# EAGLE design ev_ver_3 (EAGLE 9.6.2)
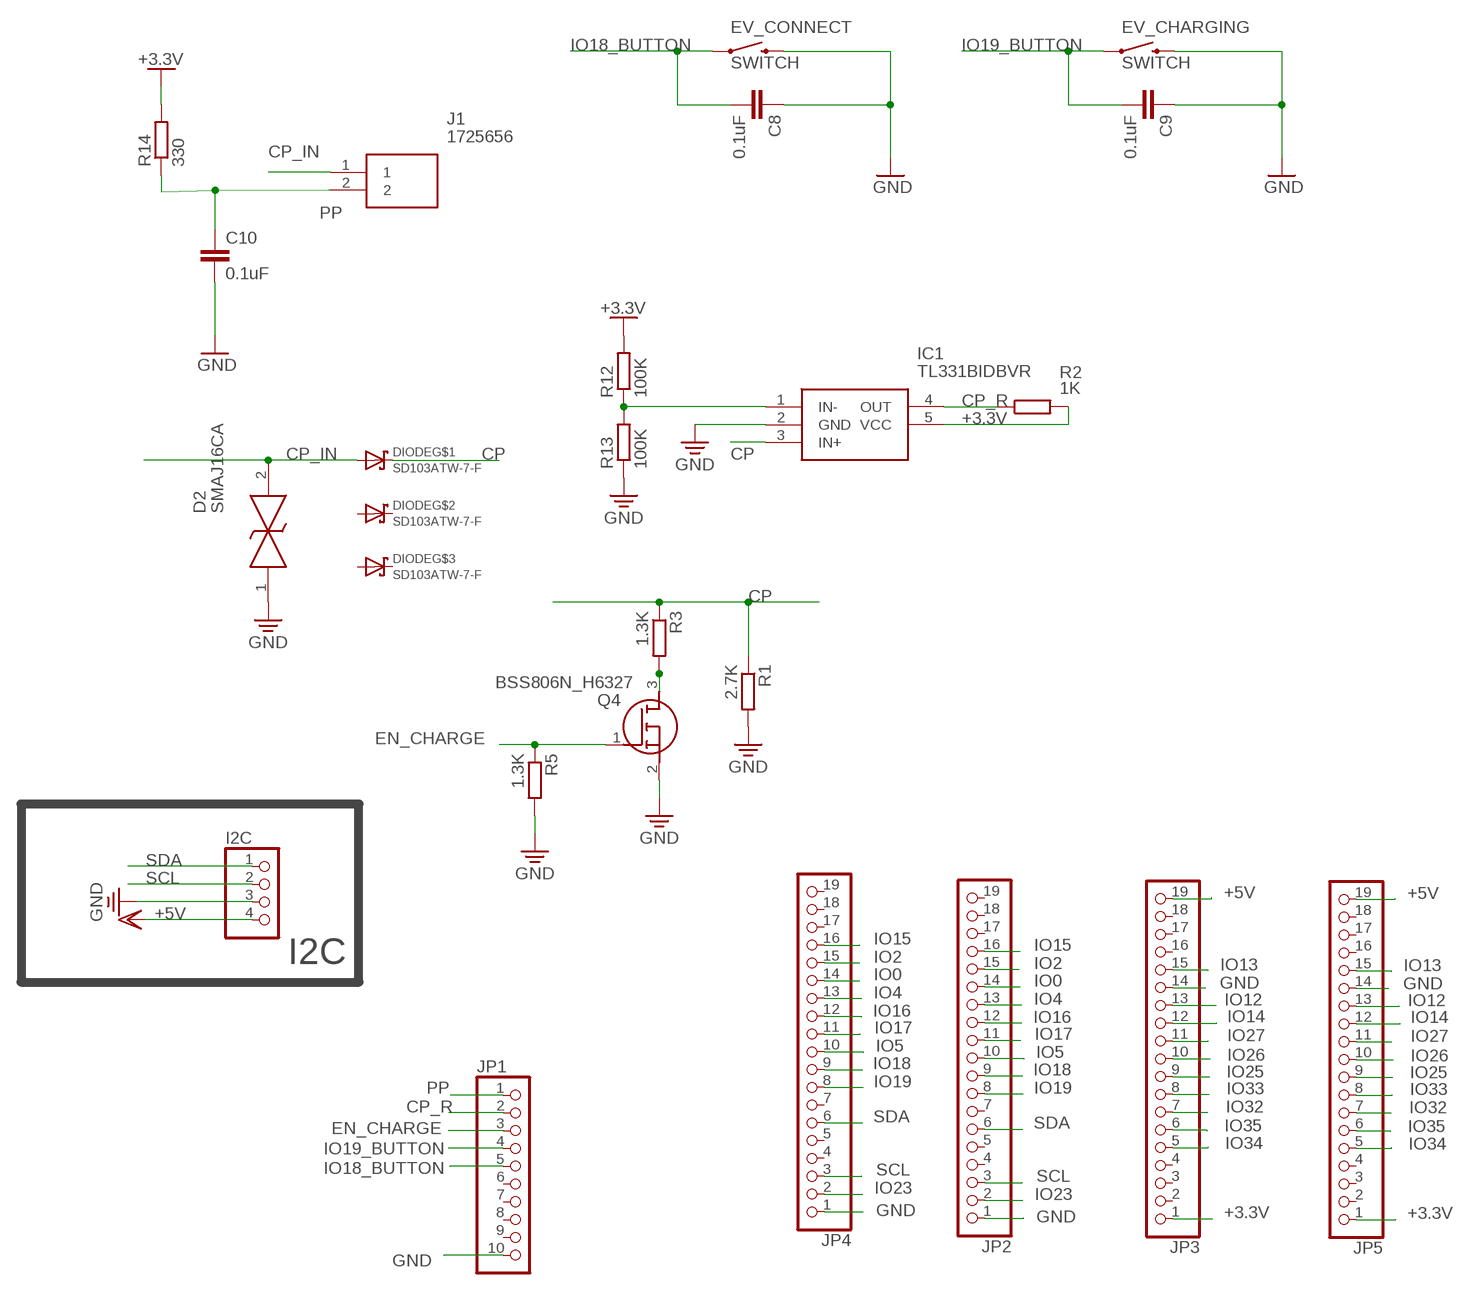
[diagram p0: schematic, sheet 1]

## Parts
C8  0.1uF  C-EUC0805  [C0805]
C9  0.1uF  C-EUC0805  [C0805]
C10  0.1uF  C-EUC0805  [C0805]
D2  SMAJ16CA  [DIOM6626X229N]
DIODE  SD103ATW-7-F  [SOT363]
EV_CHARGING  SWITCH  [SWITCH_2PIN]
EV_CONNECT  SWITCH  [SWITCH_2PIN]
I2C  PINHD-1X4  [1X04]
IC1  TL331BIDBVR  [SOT95P280X145-5N]
J1  1725656  [1725656]
JP1  PINHD-1X10  [1X10]
JP2  PINHD-1X19  [1X19]
JP3  PINHD-1X19  [1X19]
JP4  PINHD-1X19  [1X19]
JP5  PINHD-1X19  [1X19]
Q4  BSS806N_H6327  [SOT95P240X110-3N]
R1  2.7K  R-EU_R0805  [R0805]
R2  1K  R-EU_R0805  [R0805]
R3  1.3K  R-EU_R0805  [R0805]
R5  1.3K  R-EU_R0805  [R0805]
R12  100K  R-EU_R0805  [R0805]
R13  100K  R-EU_R0805  [R0805]
R14  330  R-EU_R0805  [R0805]

## Nets
+3.3V: IC1.5(VCC) JP3.1 JP5.1 R2.2 R12.2 R14.2
+5V: I2C.4 JP3.19 JP5.19 ; supply symbol labelled VDD
CP: DIODE.1(C) IC1.3(IN+) R1.1 R3.1
CP_IN: D2.2 DIODE.6(A) J1.1
CP_R: IC1.4(OUT) JP1.2 R2.1
EN_CHARGE: JP1.3 Q4.1(G) R5.1
GND: C8.1 C9.1 C10.2 D2.1 EV_CHARGING.2 EV_CONNECT.2 I2C.3 IC1.2(GND) JP1.10 JP2.1 JP3.14 JP4.1 JP5.14 Q4.2(S) R1.2 R5.2 R13.1
IO0: JP2.14 JP4.14
IO2: JP2.15 JP4.15
IO4: JP2.13 JP4.13
IO5: JP2.10 JP4.10
IO12: JP3.13 JP5.13
IO13: JP3.15 JP5.15
IO14: JP3.12 JP5.12
IO15: JP2.16 JP4.16
IO16: JP2.12 JP4.12
IO17: JP2.11 JP4.11
IO18: JP2.9 JP4.9
IO18_BUTTON: C8.2 EV_CONNECT.1 JP1.5
IO19: JP2.8 JP4.8
IO19_BUTTON: C9.2 EV_CHARGING.1 JP1.4
IO23: JP2.2 JP4.2
IO25: JP3.9 JP5.9
IO26: JP3.10 JP5.10
IO27: JP3.11 JP5.11
IO32: JP3.7 JP5.7
IO33: JP3.8 JP5.8
IO34: JP3.5 JP5.5
IO35: JP3.6 JP5.6
N$2: Q4.3(D) R3.2
N$4: IC1.1(IN-) R12.1 R13.2
PP: C10.1 J1.2 JP1.1 R14.1
SCL: I2C.2 JP2.3 JP4.3
SDA: I2C.1 JP2.6 JP4.6
Unconnected: DIODE.2(C) DIODE.3(C) DIODE.4(A) DIODE.5(A) JP1.6 JP1.7 JP1.8 JP1.9 JP2.4 JP2.5 JP2.7 JP2.17 JP2.18 JP2.19 JP3.2 JP3.3 JP3.4 JP3.16 JP3.17 JP3.18 JP4.4 JP4.5 JP4.7 JP4.17 JP4.18 JP4.19 JP5.2 JP5.3 JP5.4 JP5.16 JP5.17 JP5.18

## Notes on the sheet
- I2C

## Library data of the parts
C8-C10 = rcl:C-EU: CAPACITOR, European symbol
D2 = SMAJ16CA:SMAJ16CA: LITTELFUSE - SMAJ16CA - TVS Diode, SMAJ Series, Bidirectional, 16 V, 26 V, DO-214AC (SMA), 2 Pins Source: Datasheet <https://ms.componentsearchengine.com/Datasheets/2/SMAJ16CA.pdf>; DESCRIPTION: LITTELFUSE - SMAJ16CA - TVS Diode, SMAJ Series, Bidirectional, 16 V, 26 V, DO-214AC (SMA), 2 Pins; HEIGHT: 2.29mm; MANUFACTURER_NAME: LITTELFUSE; MANUFACTURER_PART_NUMBER: SMAJ16CA; MOUSER_PART_NUMBER: 576-SMAJ16CA; MOUSER_PRICE-STOCK: https://www.mouser.co.uk/ProductDetail/Littelfuse/SMAJ16CA?qs=zHiv0nsVGmph5UFEkGdy2g%3D%3D
DIODE = SD103ATW-7-F:SD103ATW-7-F: Diode array: 3x Such as http://www.digikey.com/product-search/en?part=SD103ATW-FDICT-ND Check availability <https://pricing.snapeda.com/parts/SD103ATW-7-F/Diodes%20Inc./view-part?ref=eda>; AVAILABILITY: In Stock; DESCRIPTION: Diode Array 3 Independent Schottky 40 V 175mA Surface Mount 6-TSSOP, SC-88, SOT-363; MF: Diodes Inc.; MP: SD103ATW-7-F; PACKAGE: SOT-363 Diodes Inc.; PRICE: None; PURCHASE-URL: https://pricing.snapeda.com/search/part/SD103ATW-7-F/?ref=eda
EV_CHARGING EV_CONNECT = all_in_one:SWITCH
I2C = pinhead:PINHD-1X4: PIN HEADER
IC1 = TL331BIDBVR:TL331BIDBVR: Analog Comparators High voltage, cost optimized, single channel comparator Source: Datasheet <https://www.ti.com/lit/gpn/TL331B>; DESCRIPTION: Analog Comparators High voltage, cost optimized, single channel comparator; HEIGHT: 1.45mm; MANUFACTURER_NAME: Texas Instruments; MANUFACTURER_PART_NUMBER: TL331BIDBVR; MOUSER_PART_NUMBER: 595-TL331BIDBVR; MOUSER_PRICE-STOCK: https://www.mouser.co.uk/ProductDetail/Texas-Instruments/TL331BIDBVR?qs=hWgE7mdIu5RvWHRCZ8GTDQ%3D%3D
J1 = 1725656:1725656: PCB terminal block, nominal current: 6 A, rated voltage (III/2): 160 V, nominal cross section: 0.5 mm?, Number of potentials: 2, Number of rows: 1, Number of positions per row: 2, product range: MPT 0,5, pitch: 2.54 mm, connection method: Screw connection with tension sleeve, mounting: Wave soldering, conductor/PCB connection direction: 0 ?, color: green, Pin layout: Linear pinning, Solder pin [P]: 3.5 mm, type of packaging: packed in cardboard Source: Datasheet <https://www.phoenixcontact.com/online/portal/us/?uri=pxc-oc-itemdetail:pid=1725656&library=usen&pcck=P-11-01-05&tab=1&selectedCategory=ALL>; DESCRIPTION: PCB terminal block, nominal current: 6 A, rated voltage (III/2): 160 V, nominal cross section: 0.5 mm?, Number of potentials: 2, Number of rows: 1, Number of positions per row: 2, product range: MPT 0,5, pitch: 2.54 mm, connection method: Screw connection with tension sleeve, mounting: Wave soldering, conductor/PCB connection direction: 0 ?, color: green, Pin layout: Linear pinning, Solder pin [P]: 3.5 mm, type of packaging: packed in cardboard; HEIGHT: 8.65mm; MANUFACTURER_NAME: Phoenix Contact; MANUFACTURER_PART_NUMBER: 1725656; MOUSER_PART_NUMBER: 651-1725656; MOUSER_PRICE-STOCK: https://www.mouser.co.uk/ProductDetail/Phoenix-Contact/1725656?qs=Ul7CXFMnlWWQeccayYbRmw%3D%3D
JP1 = pinhead:PINHD-1X10: PIN HEADER
JP2-JP5 = pinhead:PINHD-1X19: PIN HEADER
Q4 = BSS806N_H6327:BSS806N_H6327: MOSFET N-Ch 20V 2.3A SOT-23-3 Source: Datasheet <https://www.mouser.it/datasheet/2/196/Infineon-BSS806N-DS-v02_03-en-918336.pdf>; DESCRIPTION: MOSFET N-Ch 20V 2.3A SOT-23-3; HEIGHT: 1.1mm; MANUFACTURER_NAME: Infineon; MANUFACTURER_PART_NUMBER: BSS806N H6327; MOUSER_PART_NUMBER: 726-BSS806NH6327XT; MOUSER_PRICE-STOCK: https://www.mouser.co.uk/ProductDetail/Infineon-Technologies/BSS806N-H6327?qs=oPPfIaWL1l2rNBcPXSFY%252BQ%3D%3D
R1-R3 R5 R12-R14 = rcl:R-EU_: RESISTOR, European symbol

## Board
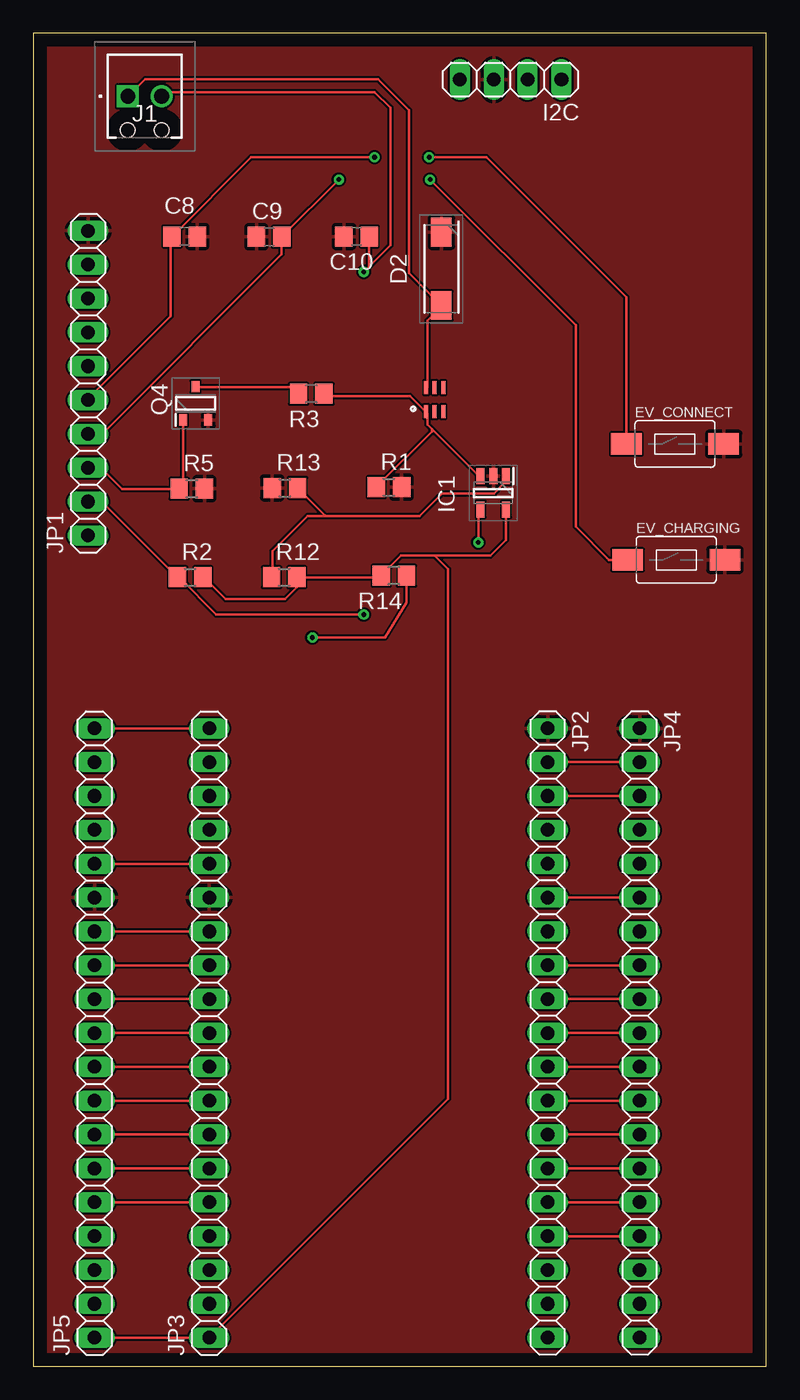
[diagram p1: board, top side]
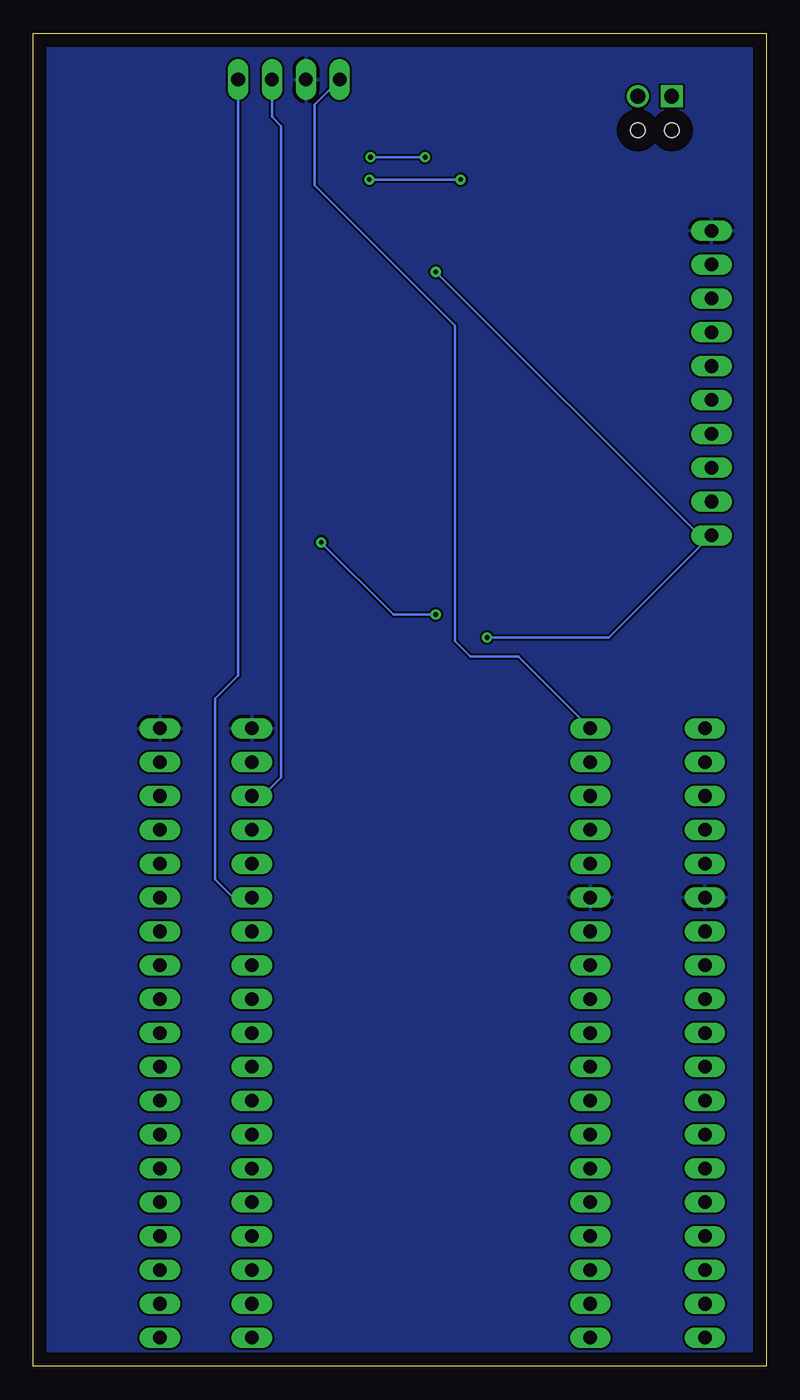
[diagram p2: board, bottom side, seen from below]

Size 55 x 100 mm. Coordinates in mm from the lower left corner, seen from the top.
Outline: 0,0 55,0 55,100 0,100 0,0
Copper layers (1*16): Top 0.035mm / dielectric 1.5mm / Bottom 0.035mm
Design rules "default *": minimum track width 0.18mm, minimum drill 0.35mm, track to track 6mil, track to pad 6mil, pad to pad 6mil, via to via 6mil, smd to smd 6mil, copper to edge 40mil, drill to drill 6mil, minimum pad ring 10mil, minimum via ring 8mil, stop-mask expansion 4mil, vias tented up to drill 0mil, thermal gap 10mil

### Footprints (pad centres in the part's own frame; a part is rotated, then mirrored left to right if it is on the bottom)
C0805 = smd 1.3 x 1.5: 1 -0.95,0; 2 0.95,0
DIOM6626X229N = smd 2.15 x 1.55: 1 -2.75,0; 2 2.75,0
SOT363 = smd 0.3 x 1: 1 -0.65,-0.9; 2 0,-0.9; 3 0.65,-0.9; 4 0.65,0.9; 5 0,0.9; 6 -0.65,0.9
SWITCH_2PIN = smd 2.3 x 1.6: 1 -3.65,0; 2 3.65,0
1X04 = drill 1.016 long: 1 -3.81,0; 2 -1.27,0; 3 1.27,0; 4 3.81,0
SOT95P280X145-5N = smd 1.2 x 0.6: 1 -1.25,0.95; 2 -1.25,0; 3 -1.25,-0.95; 4 1.25,-0.95; 5 1.25,0.95
1725656 = drill 1.1 pad 1.65 square: 1 0,0 | drill 1.1 pad 1.65: 2 2.54,0 | hole 1.1: 0,-2.54; 2.54,-2.54
1X10 = drill 1.016 long: 1 -11.43,0; 2 -8.89,0; 3 -6.35,0; 4 -3.81,0; 5 -1.27,0; 6 1.27,0; 7 3.81,0; 8 6.35,0; 9 8.89,0; 10 11.43,0
1X19 = drill 1.016 long: 1 -22.86,0; 2 -20.32,0; 3 -17.78,0; 4 -15.24,0; 5 -12.7,0; 6 -10.16,0; 7 -7.62,0; 8 -5.08,0; 9 -2.54,0; 10 0,0; 11 2.54,0; 12 5.08,0; 13 7.62,0; 14 10.16,0; 15 12.7,0; 16 15.24,0; 17 17.78,0; 18 20.32,0; 19 22.86,0
SOT95P240X110-3N = smd 0.85 x 0.6: 1 -1.25,0.95; 2 -1.25,-0.95; 3 1.25,0
R0805 = smd 1.3 x 1.5: 1 -0.95,0; 2 0.95,0

### Placement (x,y rotation side)
C8  11.36,84.76 180 top
C9  17.69,84.74 0 top
C10  24.26,84.76 180 top
D2  30.62,82.33 270 top
DIODE  30.12,72.52 0 top
EV_CHARGING  48.25,60.5 0 top
EV_CONNECT  48.16,69.19 0 top
I2C  35.82,96.53 180 top
IC1  34.52,65.52 270 top
J1  7.09,95.28 0 top
JP1  4.11,73.76 90 top
JP2  38.6,25 270 top
JP3  13.2,25 90 top
JP4  45.5,25 270 top
JP5  4.6,25 90 top
Q4  12.18,72.24 90 top
R1  26.69,65.94 0 top
R2  11.77,59.19 0 top
R3  20.86,72.96 180 top
R5  11.89,65.84 0 top
R12  18.83,59.19 0 top
R13  18.88,65.89 0 top
R14  27.06,59.31 180 top

### Tracks (layer width: path | path; a pad name or v marks a point on that pad's centre or on a via)
+3.3V
  Top 0.18: R2.2 12.8,59.17 12.82,59.17 14.42,57.57 18.88,57.57 19.78,58.47 R12.2 19.94,59.17 26.09,59.17 R14.2 | 35.4,64.32 IC1.5 | R14.2 26.26,59.33 | 35.57,64.15 IC1.5 | R14.2 27.61,60.81 30.1,60.81 | IC1.5 35.47,61.97 34.31,60.81 30.1,60.81 | JP5.1 JP3.1 31.1,20.04 31.1,59.81 30.1,60.81
+5V
  Top 0.18: JP3.19 JP5.19
  Bottom 0.18: JP3.19 18.59,53.25 22.2,53.25 23.36,54.41 23.36,78.06 33.9,88.6 33.9,94.64 I2C.4
CP
  Top 0.18: 29.92,70.3 33.41,66.81 IC1.3 | 29.92,70.3 29.58,70.64 29.58,71.47 DIODE.1 29.42,71.63 28.25,72.8 21.94,72.8 R3.1 | 29.92,70.3 29.92,70.14 25.76,65.98 R1.1
CP_IN
  Top 0.18: DIODE.6 29.58,73.46 29.58,78.45 30.58,79.44 D2.2 30.58,79.61 28.18,82.01 28.18,94.24 25.86,96.56 8.38,96.56 J1.1
CP_R  (via drill 0.35 pad 0.71)
  Top 0.18: v33.39,61.8 v33.39,61.81 33.41,61.79 33.41,64.15 IC1.4 | JP1.2 4.16,64.82 5.15,64.82 10.78,59.19 R2.1 10.97,59.17 13.74,56.4 v24.8,56.4
  Bottom 0.18: v24.8,56.4 27.98,56.4 v33.39,61.81
EN_CHARGE
  Top 0.18: Q4.1 11.23,66.14 R5.1 10.94,65.81 6.65,65.81 5.15,67.31 4.16,67.31 JP1.3
GND
  pour Top: -3,101 -3,-2 57,-2 57,102 -3,102
  pour Bottom: -4,102 -4,-3 58,-3 58,103 -4,103
IO0
  Top 0.18: JP2.14 JP4.14
IO2
  Top 0.18: JP2.15 JP4.15
IO4
  Top 0.18: JP2.13 JP4.13
IO5
  Top 0.18: JP2.10 JP4.10
IO12
  Top 0.18: JP5.13 JP3.13
IO13
  Top 0.18: JP5.15 JP3.15
IO14
  Top 0.18: JP5.12 JP3.12
IO15
  Top 0.18: JP2.16 JP4.16
IO16
  Top 0.18: JP2.12 JP4.12
IO17
  Top 0.18: JP2.11 JP4.11
IO18
  Top 0.18: JP2.9 JP4.9
IO18_BUTTON  (via drill 0.35)
  Top 0.18: C8.2 10.3,84.6 10.3,78.78 4.16,72.63 JP1.5 | 10.47,84.76 C8.2 | C8.2 16.35,90.7 v25.6,90.7 | v29.7,90.7 34,90.7 44.51,80.19 EV_CONNECT.1
  Bottom 0.18: v25.6,90.7 v29.7,90.7
IO19
  Top 0.18: JP2.8 JP4.8
IO19_BUTTON  (via drill 0.35 pad 0.71)
  Top 0.18: 18.61,84.26 18.61,84.6 C9.2 | C9.2 v22.93,89.03 | JP1.4 5.15,69.95 18.64,83.44 C9.2 | v29.78,89.03 40.7,78.11 40.7,63 43.2,60.5 EV_CHARGING.1
  Bottom 0.18: v22.93,89.03 v29.78,89.03
IO23
  Top 0.18: JP2.2 JP4.2
IO25
  Top 0.18: JP5.9 JP3.9
IO26
  Top 0.18: JP5.10 JP3.10
IO27
  Top 0.18: JP5.11 JP3.11
IO32
  Top 0.18: JP5.7 JP3.7
IO33
  Top 0.18: JP5.8 JP3.8
IO34
  Top 0.18: JP5.5 JP3.5
IO35
  Top 0.18: JP5.6 JP3.6
N$2
  Top 0.18: Q4.3 12.3,73.46 19.28,73.46 19.78,72.96 R3.2
N$4
  Top 0.18: 21.9,63.79 20.57,63.79 17.95,61.16 17.95,59.33 R12.1 | 21.9,63.79 28.99,63.79 30.68,65.48 34.57,65.48 35.4,66.31 35.4,66.65 IC1.1 | 19.94,65.81 R13.2 21.9,63.82 21.9,63.79
PP  (via drill 0.35)
  Top 0.18: v20.94,54.67 26.39,54.67 28.01,57.3 R14.1 | 25.21,82.51 26.8,84.1 26.8,94.4 25.6,95.6 10,95.6 9.95,95.6 J1.2 | 25.21,82.51 v24.8,82.1 | C10.1 25.21,82.51
  Bottom 0.18: v20.94,54.67 11.81,54.67 4.16,62.33 JP1.1 4.99,62.33 24.76,82.1 v24.8,82.1
SCL
  Top 0.18: JP2.3 JP4.3
  Bottom 0.18: I2C.2 37.09,93.73 36.4,93.04 36.4,44.18 37.8,42.78 JP2.3
SDA
  Top 0.18: JP2.6 JP4.6
  Bottom 0.18: I2C.1 39.63,51.81 41.37,50.08 41.37,36.53 40,35.16 JP2.6